# Altium schematic sheet SLA_5v2A_Schem.SchDoc
size A4
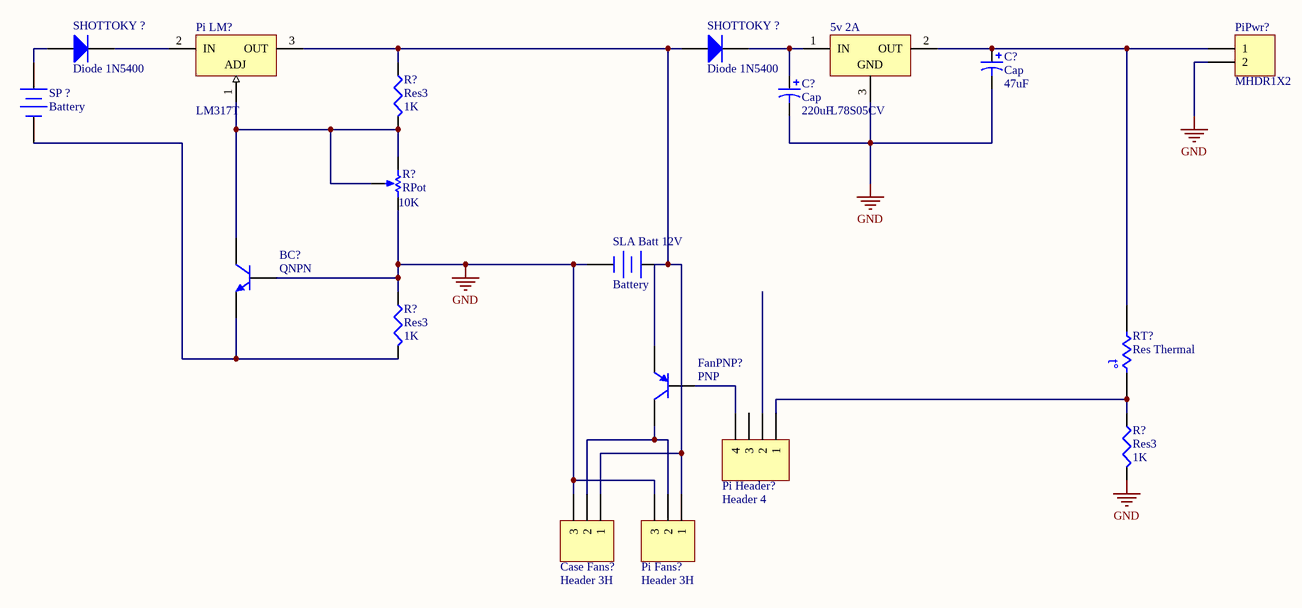
[diagram p0: SLA_5v2A_Schem.SchDoc]

## Parts
(Parts that share a designator on the sheet are numbered #1, #2 ... from top to bottom, then left to right.)
5v_2A  L78S05CV  [TO220VW]
BC?  QNPN  [SOT-23B_M]
C?#1  Cap  value 47uF  [C0805]
C?#2  Cap  value 220uF  [C0805]
Case_Fans?  Header 3H  [HDR1X3H]
FanPNP?  PNP  [SOT-23B_N]
Pi_Fans?  Header 3H  [HDR1X3H]
Pi_Header?  Header 4  [HDR1X4]
Pi_LM?  LM317T  [TO220ABN]
PiPwr?  MHDR1X2  [MHDR1X2]
R?#1  Res3  value 1K  [J1-0603]
R?#2  RPot  value 10K  [VR5]
R?#3  Res3  value 1K  [J1-0603]
R?#4  Res3  value 1K  [J1-0603]
RT?  Res Thermal  [6-0805_N]
SHOTTOKY_?#1  Diode 1N5400  [DO-201AD]
SHOTTOKY_?#2  Diode 1N5400  [DO-201AD]
SLA_Batt_12V  Battery  [BAT-2]
SP_?  Battery  [BAT-2]

## Nets
GND: 5v_2A.3(GND) BC?.2(B) C?#1.2 C?#2.2 Case_Fans?.3 Pi_Fans?.3 PiPwr?.2 R?#2.2(BOT) R?#3.1 R?#4.2 SLA_Batt_12V.2(-)
Net5v_2A_1: 5v_2A.1(IN) C?#2.1 SHOTTOKY_?#2.2(K)
Net5v_2A_2: 5v_2A.2(OUT) C?#1.1 PiPwr?.1 RT?.2
NetBC?_1: BC?.1(C) Pi_LM?.1(ADJ) R?#1.2 R?#2.1(TOP) R?#2.3(TAP)
NetBC?_3: BC?.3(E) R?#3.2 SP_?.2(-)
NetCase_Fans?_1: Case_Fans?.1 FanPNP?.3(E) Pi_Fans?.1 Pi_LM?.3(OUT) R?#1.1 SHOTTOKY_?#2.1(A) SLA_Batt_12V.1(+)
NetCase_Fans?_2: Case_Fans?.2 FanPNP?.1(C) Pi_Fans?.2
NetFanPNP?_2: FanPNP?.2(B) Pi_Header?.4
NetPi_Header?_1: Pi_Header?.1 R?#4.1 RT?.1
NetPi_LM?_2: Pi_LM?.2(IN) SHOTTOKY_?#1.2(K)
NetSHOTTOKY_?#1_1: SHOTTOKY_?#1.1(A) SP_?.1(+)

Not connected (* = marked no-connect by the designer): Pi_Header? 2 3

## Notes on the sheet
- (in symbol Res Thermal) t°

## Library data of the parts
5v_2A = L78S05CV: 2A Positive Voltage Regulator; Note: Tab is connected to pin 3 (GND).; Published: 24-Aug-2001; LatestRevisionDate: 17-Jul-2002; LatestRevisionNote: Re-released for DXP Platform.; DatasheetVersion: Jan-1993; PackageVersion: Apr-1998; PackageReference: TO220VW; Publisher: Altium Limited; PackageDescription: TO, Thru-Hole, Vertical, Heatsink Mounted; 3 In-Line Leads; Pitch 2.54 mm; Pin sequence 1, 3, 2; ComponentLink1Description: Manufacturer Link; ComponentLink1URL: http://www.st.com/; ComponentLink2Description: Datasheet; ComponentLink2URL: http://www.st.com/stonline/products/literature/ds/2148/l78s10c.pdf
BC? = QNPN: NPN Bipolar Transistor; Published: 8-Jun-2000; LatestRevisionDate: 29-May-2009; LatestRevisionNote: IPC-7351 Footprint Added.; PackageVersion: Aug-1999; PackageReference: SOT-23B; Publisher: Altium Limited; PackageDescription: 3-Pin SOT-23 Package 0.95 mm Pitch, 2.4 mm Lead Span
C?#1 C?#2 = Cap Pol3: Polarized Capacitor (Surface Mount); Published: 8-Jun-2000; LatestRevisionDate: 29-May-2009; LatestRevisionNote: IPC-7351 Footprint Added.; PackageReference: C0805; Publisher: Altium Limited; PackageDescription: Chip Capacitor
Case_Fans? Pi_Fans? = Header 3H: Header, 3-Pin, Right Angle; LatestRevisionDate: 17-Jul-2002; LatestRevisionNote: Re-released for DXP Platform.; Publisher: Altium Limited
FanPNP? = PNP: PNP Bipolar Transistor; Published: 8-Jun-2000; LatestRevisionDate: 29-May-2009; LatestRevisionNote: IPC-7351 Footprint Added.; PackageVersion: Aug-1999; PackageReference: SOT-23B; Publisher: Altium Limited; PackageDescription: 3-Pin SOT-23 Package 0.95 mm Pitch, 2.4 mm Lead Span
Pi_Header? = Header 4: Header, 4-Pin; LatestRevisionDate: 17-Jul-2002; LatestRevisionNote: Re-released for DXP Platform.; Publisher: Altium Limited
Pi_LM? = LM317T: 1.2V to 37V Voltage Regulator; Note: Tab is connected to pin 3 (OUT).; Published: 24-Aug-2001; LatestRevisionDate: 17-Jul-2002; LatestRevisionNote: Re-released for DXP Platform.; DatasheetVersion: Nov-1999; PackageVersion: Jun-1998; PackageReference: TO220ABN; Publisher: Altium Limited; PackageDescription: TO, Thru-Hole, Vertical, Heatsink Mounted; 3 In-Line Leads; Pitch 2.54 mm; Pin sequence 1, 3, 2; ComponentLink1Description: Manufacturer Link; ComponentLink1URL: http://www.st.com/; ComponentLink2Description: Datasheet; ComponentLink2URL: http://www.st.com/stonline/products/literature/ds/2154/lm117.pdf
PiPwr? = MHDR1X2: Header, 2-Pin; LatestRevisionDate: 17-Jul-2002; LatestRevisionNote: Re-released for DXP Platform.; Publisher: Altium Limited
R?#1 R?#3 R?#4 = Res3: Resistor; Published: 8-Jun-2000; LatestRevisionDate: 29-May-2009; LatestRevisionNote: IPC-7351 Footprint Added.; PackageReference: J1-0603; Publisher: Altium Limited; PackageDescription: Chip Resistor
R?#2 = RPot: Potentiometer; Sim Note: Enter the Resistance value and the set point into parameter fields.; Set Position: 0.5; Published: 8-Jun-2000; LatestRevisionDate: 17-Jul-2002; LatestRevisionNote: Re-released for DXP Platform.; PackageReference: VR5; Publisher: Altium Limited; PackageDescription: Variable Resistor, Thru-Hole; 3 Leads
RT? = Res Thermal: Thermistor; Published: 24-Mar-1999; LatestRevisionDate: 29-May-2009; LatestRevisionNote: IPC-7351 Footprint Added.; PackageVersion: Mar-2003; PackageReference: 6-0805; Publisher: Altium Limited; PackageDescription: Chip Resistor 0805 Case Size; Code_IPC: RESC2012
SHOTTOKY_?#1 SHOTTOKY_?#2 = Diode 1N5400: 3 Amp General Purpose Rectifier; Published: 8-Jun-2000; LatestRevisionDate: 17-Jul-2002; LatestRevisionNote: Re-released for DXP Platform.; DatasheetVersion: 1998; PackageVersion: Aug-1999; PackageReference: DO-201AD; Publisher: Altium Limited; PackageDescription: Diode, Axial; Body 9.5 x 5.6 mm (LxDia. max), Lead Dia. 1.32 mm (max); ComponentLink1Description: Manufacturer Link; ComponentLink1URL: http://www.fairchildsemi.com/; ComponentLink2Description: Datasheet; ComponentLink2URL: http://www.fairchildsemi.com/ds/1N%2F1N5400.pdf
SLA_Batt_12V SP_? = Battery: Multicell Battery; Published: 24-Mar-1999; LatestRevisionDate: 17-Jul-2002; LatestRevisionNote: Re-released for DXP Platform.; PackageReference: BAT-2; Publisher: Altium Limited; PackageDescription: Battery; 2 Leads